# EAGLE design reg (EAGLE 9.6.2)
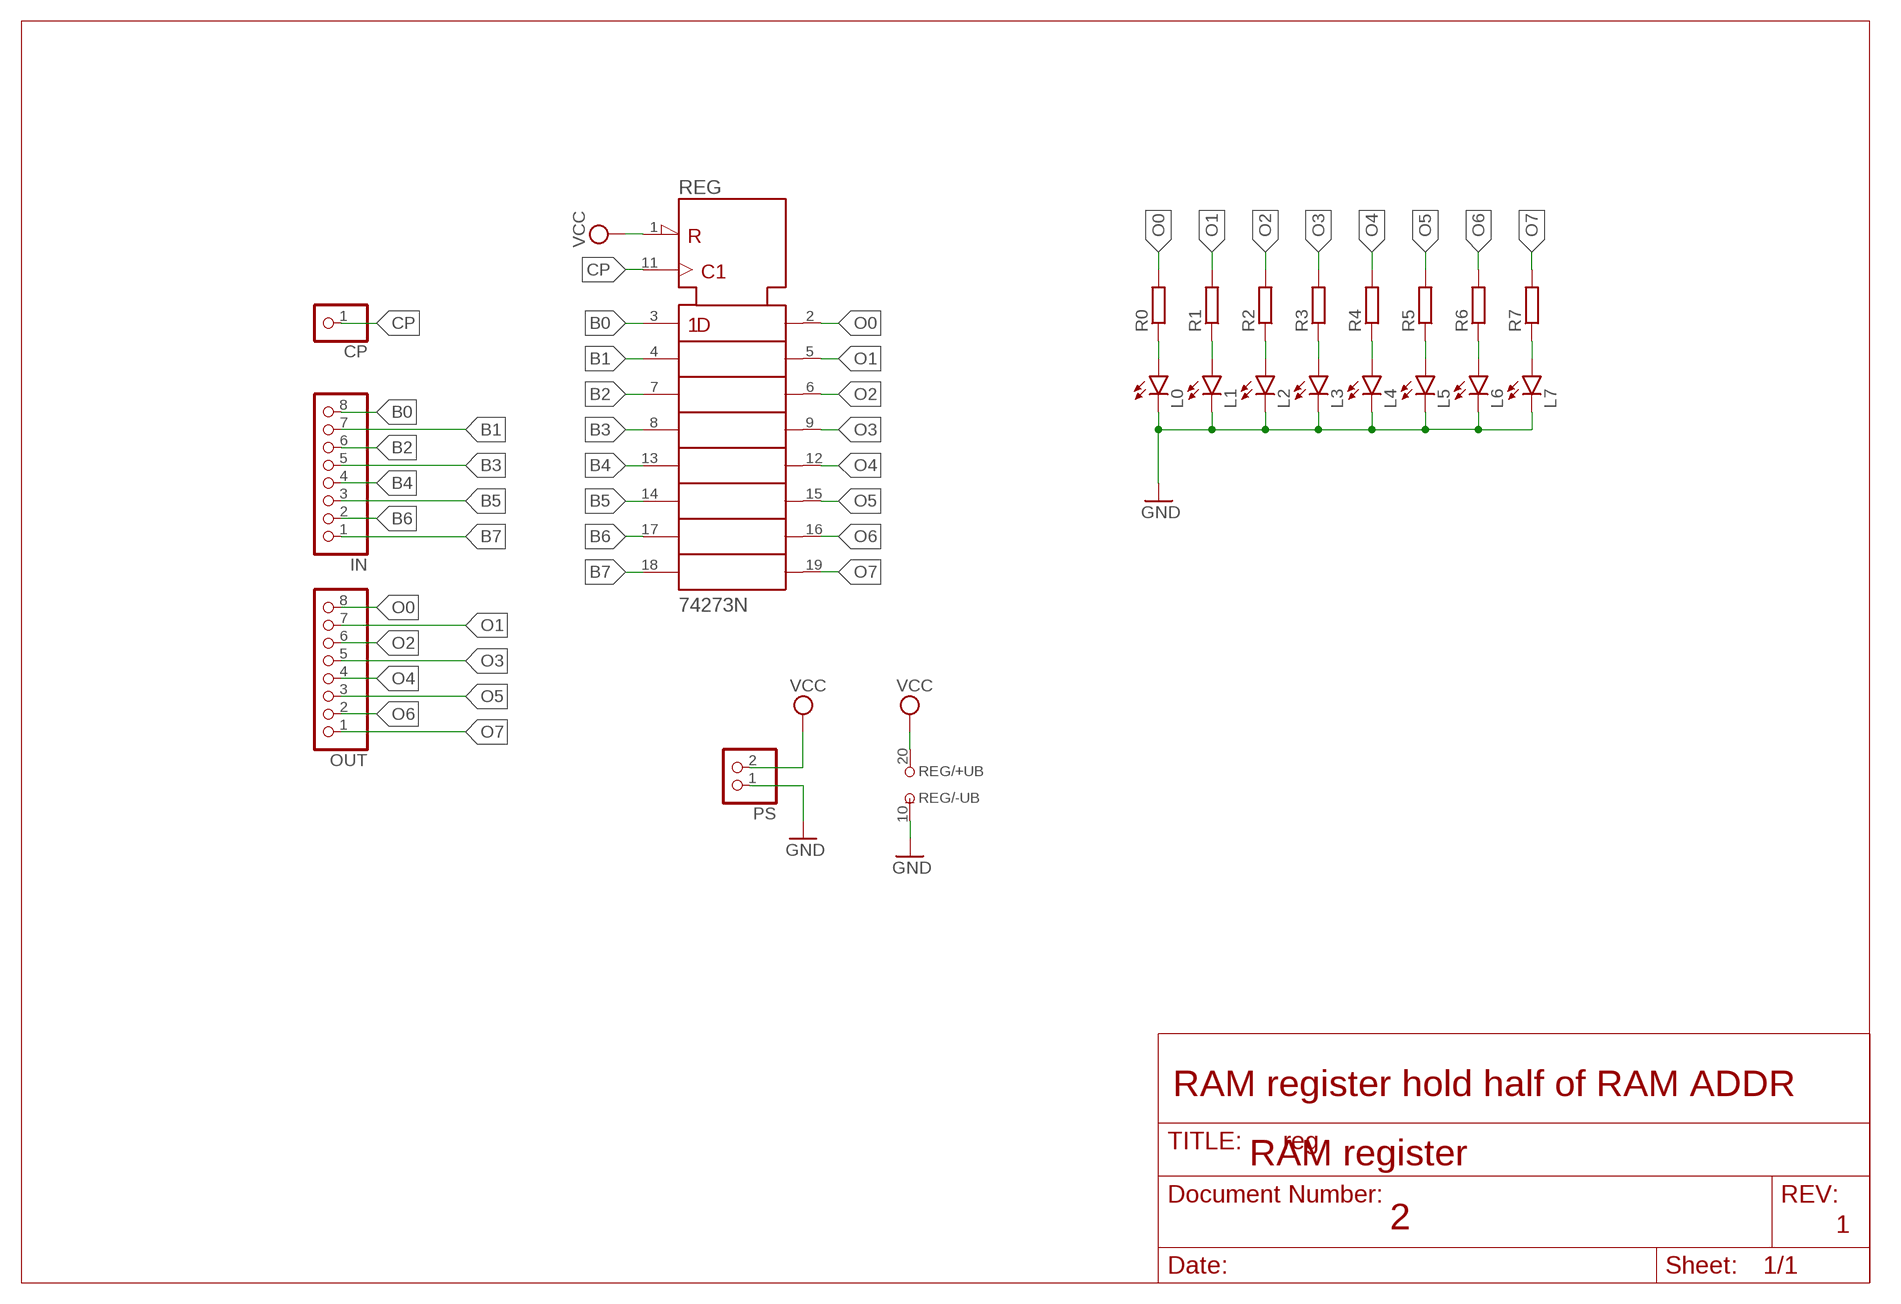
[diagram p0: schematic, sheet 1]

## Parts
CP  PINHD-1X1  [1X01]
IN  PINHD-1X8  [1X08]
L0  LED5MM  [LED5MM]
L1  LED5MM  [LED5MM]
L2  LED5MM  [LED5MM]
L3  LED5MM  [LED5MM]
L4  LED5MM  [LED5MM]
L5  LED5MM  [LED5MM]
L6  LED5MM  [LED5MM]
L7  LED5MM  [LED5MM]
OUT  PINHD-1X8  [1X08]
PS  PINHD-1X2  [1X02]
R0  R-EU_0204/7  [0204/7]
R1  R-EU_0204/7  [0204/7]
R2  R-EU_0204/7  [0204/7]
R3  R-EU_0204/7  [0204/7]
R4  R-EU_0204/7  [0204/7]
R5  R-EU_0204/7  [0204/7]
R6  R-EU_0204/7  [0204/7]
R7  R-EU_0204/7  [0204/7]
REG  74273N  [DIL20]

## Nets
B0: IN.8 REG.3(1D)
B1: IN.7 REG.4(2D)
B2: IN.6 REG.7(3D)
B3: IN.5 REG.8(4D)
B4: IN.4 REG.13(5D)
B5: IN.3 REG.14(6D)
B6: IN.2 REG.17(7D)
B7: IN.1 REG.18(8D)
CP: CP.1 REG.11(CLK)
GND: L0.K(C) L1.K(C) L2.K(C) L3.K(C) L4.K(C) L5.K(C) L6.K(C) L7.K(C) PS.1 REG.10(-UB)
N$1: L0.A R0.1
N$2: L1.A R1.1
N$3: L2.A R2.1
N$4: L3.A R3.1
N$5: L4.A R4.1
N$6: L5.A R5.1
N$7: L6.A R6.1
N$8: L7.A R7.1
O0: OUT.8 R0.2 REG.2(1Q)
O1: OUT.7 R1.2 REG.5(2Q)
O2: OUT.6 R2.2 REG.6(3Q)
O3: OUT.5 R3.2 REG.9(4Q)
O4: OUT.4 R4.2 REG.12(5Q)
O5: OUT.3 R5.2 REG.15(6Q)
O6: OUT.2 R6.2 REG.16(7Q)
O7: OUT.1 R7.2 REG.19(8Q)
VCC: PS.2 REG.1(!CLR) REG.20(+UB)

## Notes on the sheet
- RAM register hold half of RAM ADDR
- RAM register
- 2 | 1

## Library data of the parts
CP = pinhead:PINHD-1X1: PIN HEADER
IN OUT = pinhead:PINHD-1X8: PIN HEADER
L0 L1-L7 = led:LED: LED OSRAM: - CHIPLED LG R971, LG N971, LY N971, LG Q971, LY Q971, LO R971, LY R971 LH N974, LH R974 LS Q976, LO Q976, LY Q976 LO Q996 - Hyper CHIPLED LW Q18S LB Q993, LB Q99A, LB R99A - SideLED LS A670, LO A670, LY A670, LG A670, LP A670 LB A673, LV A673, LT A673, LW A673 LH A674 LY A675 LS A676, LA A676, LO A676, LY A676, LW A676 LS A679, LY A679, LG A679 - Hyper Micro SIDELED® LS Y876, LA Y876, LO Y876, LY Y876 LT Y87S - SmartLED LW L88C, LW L88S LB L89C, LB L89S, LG L890 LS L89K, LO L89K, LY L89K LS L896, LA L896, LO L896, LY L896 - TOPLED LS T670, LO T670, LY T670, LG T670, LP T670 LSG T670, LSP T670, LSY T670, LOP T670, LYG T670 LG T671, LOG T671, LSG T671 LB T673, LV T673, LT T673, LW T673 LH T674 LS T676, LA T676, LO T676, LY T676, LB T676, LH T676, LSB T676, LW T676 LB T67C, LV T67C, LT T67C, LS T67K, LO T67K, LY T67K, LW E67C LS E67B, LA E67B, LO E67B, LY E67B, LB E67C, LV E67C, LT E67C LW T67C LS T679, LY T679, LG T679 LS T770, LO T770, LY T770, LG T770, LP T770 LB T773, LV T773, LT T773, LW T773 LH T774 LS E675, LA E675, LY E675, LS T675 LS T776, LA T776, LO T776, LY T776, LB T776 LHGB T686 LT T68C, LB T68C - Hyper Mini TOPLED® LB M676 - Mini TOPLED Santana® LG M470 LS M47K, LO M47K, LY M47K Source: http://www.osram.convergy.de LUXEON: - LUMILED® LXK2-PW12-R00, LXK2-PW12-S00, LXK2-PW14-U00, LXK2-PW14-V00 LXK2-PM12-R00, LXK2-PM12-S00, LXK2-PM14-U00 LXK2-PE12-Q00, LXK2-PE12-R00, LXK2-PE12-S00, LXK2-PE14-T00, LXK2-PE14-U00 LXK2-PB12-K00, LXK2-PB12-L00, LXK2-PB12-M00, LXK2-PB14-N00, LXK2-PB14-P00, LXK2-PB14-Q00 LXK2-PR12-L00, LXK2-PR12-M00, LXK2-PR14-Q00, LXK2-PR14-R00 LXK2-PD12-Q00, LXK2-PD12-R00, LXK2-PD12-S00 LXK2-PH12-R00, LXK2-PH12-S00 LXK2-PL12-P00, LXK2-PL12-Q00, LXK2-PL12-R00 Source: www.luxeon.com KINGBRIGHT: KA-3528ASYC Source: www.kingbright.com
PS = pinhead:PINHD-1X2: PIN HEADER
R0 R1-R7 = rcl:R-EU_: RESISTOR, European symbol; SPICEPREFIX: R
REG = 74ttl-din:74*273: Octal D type FLIP FLOP, clear

## Board
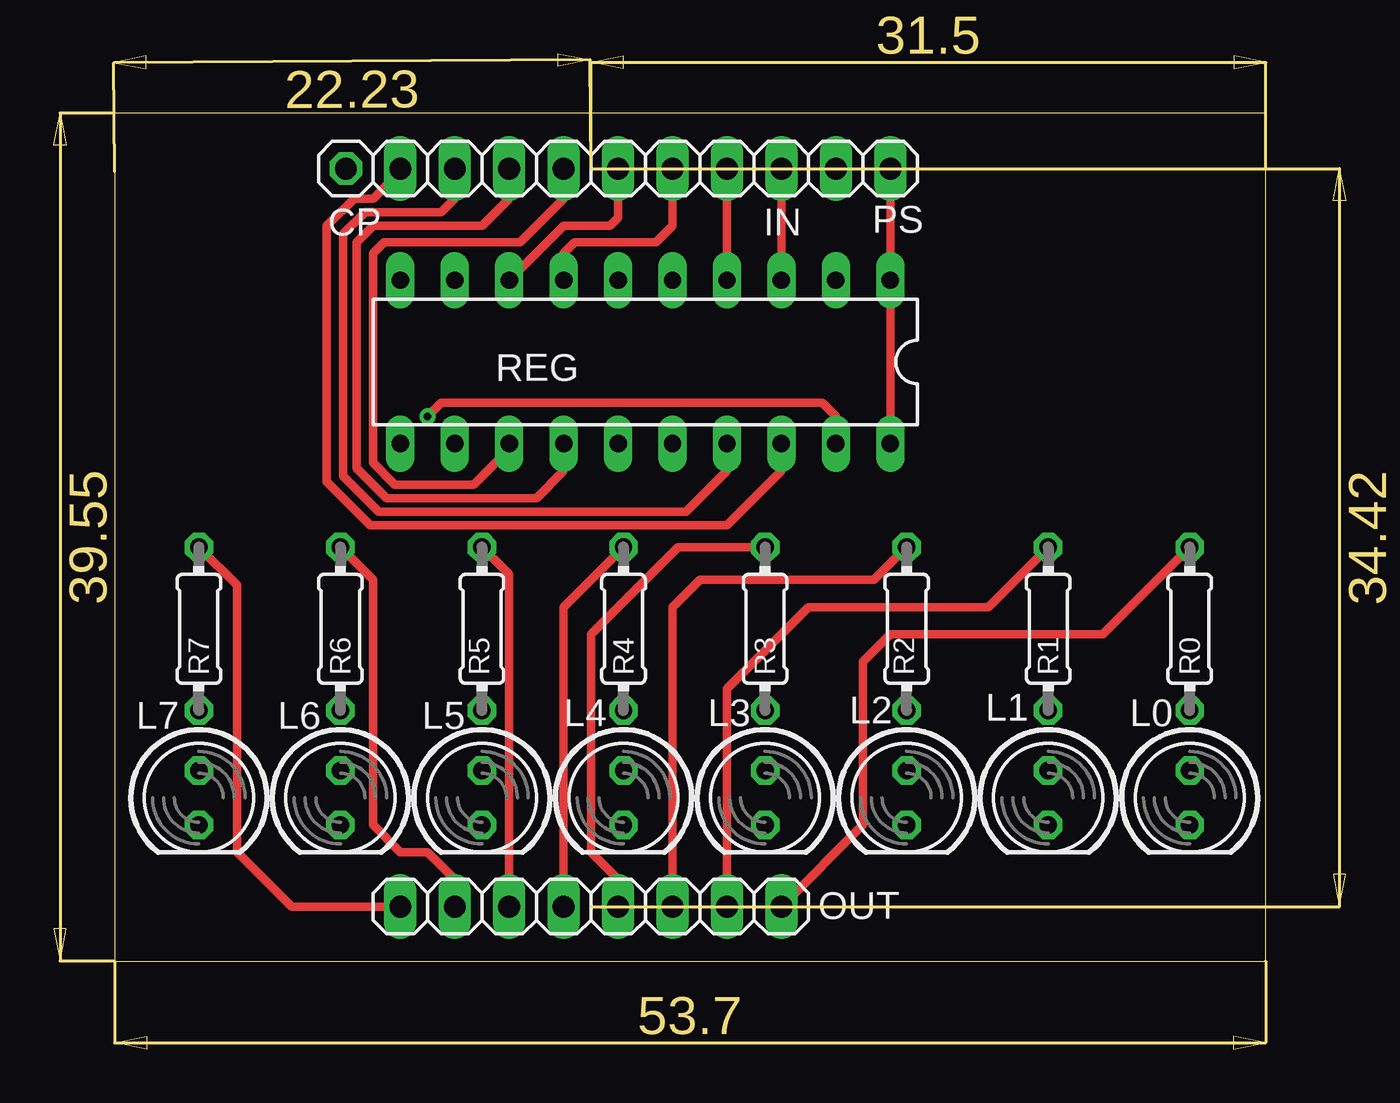
[diagram p1: board, top side]
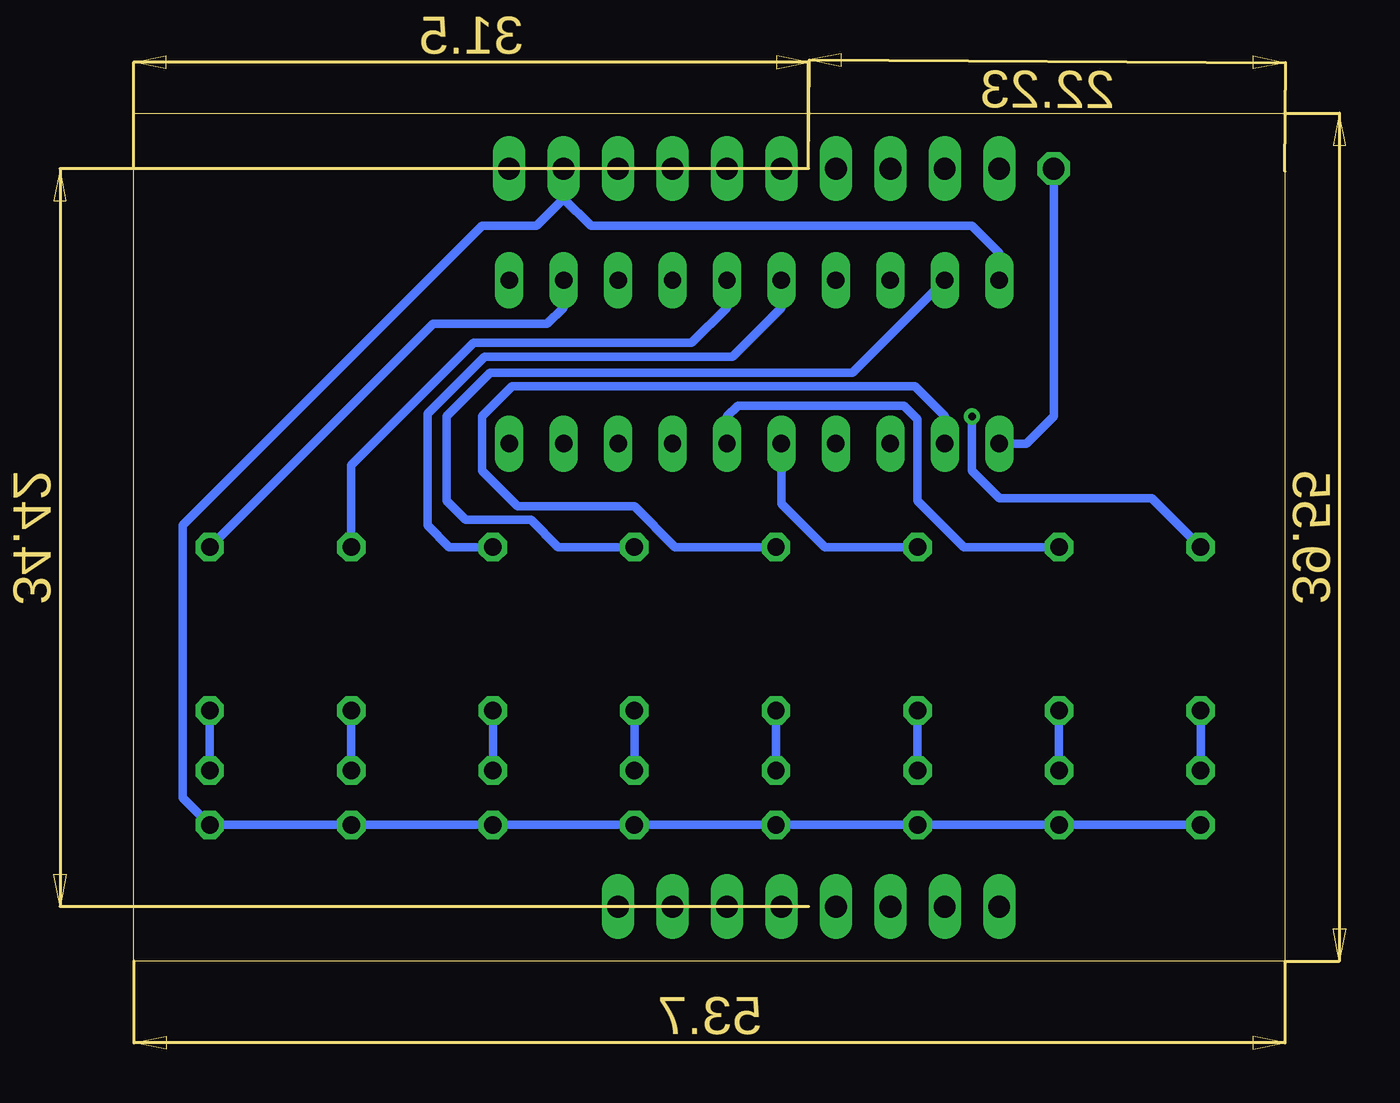
[diagram p2: board, bottom side, seen from below]

Size 53.7 x 39.55 mm. Coordinates in mm from the lower left corner, seen from the top.
Outline: 0,0 53.7,0 53.7,39.55 0,39.55 0,0
Copper layers (1*16): Top 0.035mm / dielectric 1.5mm / Bottom 0.035mm
Design rules "default": minimum track width 6mil, minimum drill 0.35mm, track to track 6mil, track to pad 6mil, pad to pad 6mil, via to via 6mil, smd to smd 6mil, copper to edge 40mil, drill to drill 6mil, minimum pad ring 10mil, minimum via ring 8mil, stop-mask expansion 4mil, vias tented up to drill 0mil, thermal gap 10mil

### Footprints (pad centres in the part's own frame; a part is rotated, then mirrored left to right if it is on the bottom)
1X01 = drill 1.016 octagon: 1 0,0
1X08 = drill 1.016 long: 1 -8.89,0; 2 -6.35,0; 3 -3.81,0; 4 -1.27,0; 5 1.27,0; 6 3.81,0; 7 6.35,0; 8 8.89,0
LED5MM = drill 0.813 octagon: A -1.27,0; K 1.27,0
1X02 = drill 1.016 long: 1 -1.27,0; 2 1.27,0
0204/7 = drill 0.813 octagon: 1 -3.81,0; 2 3.81,0
DIL20 = drill 0.813 long: 1 -11.43,-3.81; 2 -8.89,-3.81; 3 -6.35,-3.81; 4 -3.81,-3.81; 5 -1.27,-3.81; 6 1.27,-3.81; 7 3.81,-3.81; 8 6.35,-3.81; 9 8.89,-3.81; 10 11.43,-3.81; 11 11.43,3.81; 12 8.89,3.81; 13 6.35,3.81; 14 3.81,3.81; 15 1.27,3.81; 16 -1.27,3.81; 17 -3.81,3.81; 18 -6.35,3.81; 19 -8.89,3.81; 20 -11.43,3.81

### Placement (x,y rotation side)
CP  10.79,36.96 0 top
IN  22.23,36.96 0 top
L0  50.16,7.62 270 top
L1  43.56,7.62 270 top
L2  36.96,7.62 270 top
L3  30.35,7.62 270 top
L4  23.75,7.62 270 top
L5  17.14,7.62 270 top
L6  10.54,7.62 270 top
L7  3.94,7.62 270 top
OUT  22.23,2.54 0 top
PS  34.92,36.96 0 top
R0  50.16,15.49 90 top
R1  43.56,15.49 90 top
R2  36.96,15.49 90 top
R3  30.35,15.49 90 top
R4  23.75,15.49 90 top
R5  17.14,15.49 90 top
R6  10.54,15.49 90 top
R7  3.94,15.49 90 top
REG  24.77,27.94 180 top

### Tracks (layer width: path | path; a pad name or v marks a point on that pad's centre or on a via)
B0
  Top 0.4: REG.3 IN.8
B1
  Top 0.4: IN.7 REG.4
B2
  Top 0.4: REG.7 20.95,33.02 21.46,33.53 25.27,33.53 26.04,34.29 IN.6
B3
  Top 0.4: REG.8 20.95,34.29 23.11,34.29 23.5,34.67 IN.5
B4
  Top 0.4: IN.4 20.95,35.56 18.92,33.53 12.57,33.53 12.06,33.02 12.06,23.24 13.08,22.23 16.76,22.23 18.41,23.88 REG.13
B5
  Top 0.4: REG.14 20.95,22.86 19.68,21.59 12.7,21.59 11.3,22.99 11.3,33.53 12.06,34.29 17.14,34.29 18.41,35.56 IN.3
B6
  Top 0.4: REG.17 28.57,22.86 26.67,20.95 12.32,20.95 10.67,22.61 10.67,33.91 11.68,34.92 15.24,34.92 15.88,35.56 IN.2
B7
  Top 0.4: IN.1 13.34,36.83 12.06,35.56 11.18,35.56 9.91,34.29 9.91,22.35 11.94,20.32 28.57,20.32 31.11,22.86 REG.18
CP
  Bottom 0.4: CP.1 10.79,25.4 12.06,24.13 REG.11
GND
  Bottom 0.4: REG.10 13.34,33.02 14.61,34.29 32.38,34.29 33.66,35.56 | 33.66,35.56 PS.1 | L7.K L6.K L5.K L4.K L3.K L2.K L1.K L0.K 51.44,7.62 51.44,20.32 37.47,34.29 34.92,34.29 33.66,35.56
N$1
  Bottom 0.4: R0.1 L0.A
N$2
  Bottom 0.4: L1.A R1.1
N$3
  Bottom 0.4: R2.1 L2.A
N$4
  Bottom 0.4: L3.A R3.1
N$5
  Bottom 0.4: R4.1 L4.A
N$6
  Bottom 0.4: L5.A R5.1
N$7
  Bottom 0.4: R6.1 L6.A
N$8
  Bottom 0.4: L7.A R7.1
O0
  Top 0.4: OUT.8 34.92,6.35 34.92,13.97 36.2,15.24 46.1,15.24 R0.2
  Bottom 0.4: REG.2 33.66,30.48 34.42,29.72 39.75,29.72 R0.2
O1
  Top 0.4: OUT.7 28.57,12.7 32.38,16.51 40.77,16.51 R1.2
  Bottom 0.4: R1.2 43.56,23.11 37.85,28.83 27.69,28.83 26.04,30.48 REG.5
O2
  Top 0.4: OUT.6 26.04,16.51 27.3,17.78 35.43,17.78 R2.2
  Bottom 0.4: REG.6 23.5,30.48 25.78,28.19 37.34,28.19 40.01,25.53 40.01,20.32 38.99,19.3 R2.2
O3
  Top 0.4: OUT.5 23.5,3.81 22.23,5.08 22.23,15.24 26.29,19.3 R3.2
  Bottom 0.4: R3.2 33.91,19.3 35.18,20.57 38.23,20.57 39.12,21.46 39.12,25.4 37.08,27.43 20.19,27.43 REG.9
O4
  Top 0.4: OUT.4 20.95,16.51 R4.2
  Bottom 0.4: REG.12 15.88,25.4 17.27,26.8 36.07,26.8 37.47,25.4 37.47,22.86 35.81,21.21 30.35,21.21 28.45,19.3 R4.2
O5
  Top 0.4: R5.2 18.41,18.03 OUT.3
  Bottom 0.4: R5.2 21.46,19.3 23.5,21.34 REG.15
O6
  Top 0.4: OUT.2 15.88,3.81 14.61,5.08 13.34,5.08 12.06,6.35 12.06,17.78 R6.2
  Bottom 0.4: REG.16 26.04,25.4 25.53,25.91 17.78,25.91 17.14,25.27 17.14,21.46 14.99,19.3 R6.2
O7  (via drill 0.35)
  Top 0.4: REG.19 33.66,25.4 33.02,26.04 15.24,26.04 v14.61,25.4 | OUT.1 8.26,2.54 5.71,5.08 5.71,17.53 R7.2
  Bottom 0.4: v14.61,25.4 14.61,22.86 13.34,21.59 6.22,21.59 R7.2
VCC
  Top 0.4: REG.20 REG.1 PS.2